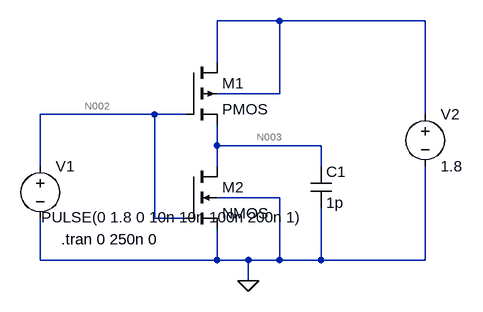
[diagram p0: schematic cmos transient.asc]
cmos transient.asc, the LTspice schematic file:
Version 4
SHEET 1 880 680
WIRE 256 0 160 0
WIRE 480 0 256 0
WIRE 160 64 160 0
WIRE 256 112 256 0
WIRE 256 112 160 112
WIRE 64 144 -112 144
WIRE 112 144 64 144
WIRE 480 144 480 0
WIRE 160 192 160 160
WIRE 320 192 160 192
WIRE -112 224 -112 144
WIRE 160 224 160 192
WIRE 320 224 320 192
WIRE 256 272 160 272
WIRE 64 304 64 144
WIRE 112 304 64 304
WIRE -112 368 -112 304
WIRE 160 368 160 320
WIRE 160 368 -112 368
WIRE 208 368 160 368
WIRE 256 368 256 272
WIRE 256 368 208 368
WIRE 320 368 320 288
WIRE 320 368 256 368
WIRE 480 368 480 224
WIRE 480 368 320 368
WIRE 208 400 208 368
FLAG 208 400 0
SYMBOL pmos4 112 64 R0
SYMATTR InstName M1
SYMATTR Value2 l=180n w=450n
SYMBOL nmos4 112 224 R0
SYMATTR InstName M2
SYMATTR Value2 l=180n w=900n
SYMBOL voltage -112 208 R0
WINDOW 123 0 0 Left 0
WINDOW 39 0 0 Left 0
WINDOW 3 204 110 Bottom 2
SYMATTR InstName V1
SYMATTR Value PULSE(0 1.8 0 10n 10n 100n 200n 1)
SYMBOL voltage 480 128 R0
WINDOW 123 0 0 Left 0
WINDOW 39 0 0 Left 0
SYMATTR InstName V2
SYMATTR Value 1.8
SYMBOL cap 304 224 R0
SYMATTR InstName C1
SYMATTR Value 1p
TEXT -80 336 Left 2 !.tran 0 250n 0

The netlist it stands for:
* cmos transient.asc
M1 N001 N002 N003 N001 PMOS l=180n w=450n
M2 N003 N002 0 0 NMOS l=180n w=900n
V1 N002 0 PULSE(0 1.8 0 10n 10n 100n 200n 1)
V2 N001 0 1.8
C1 N003 0 1p
.model NMOS NMOS
.model PMOS PMOS
.lib standard.mos
.tran 0 250n 0
.backanno
.end

* Results of the author's LTspice run, read from the files saved beside the schematic
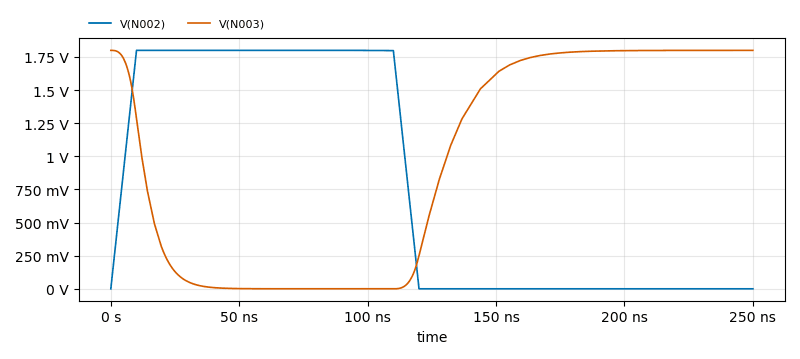
[diagram p1: Transient Analysis of cmos transient.asc, plotted from the saved traces]
* Transient Analysis, 1 run:
*   V(N002): min 0 V, max 1.8 V, average 791.9 mV, rms 1.176 V, last 0 V
*   V(N003): min 0 V, max 1.8 V, average 950 mV, rms 1.255 V, last 1.8 V